# EAGLE design probe_v2.1 (EAGLE 8.5.2)
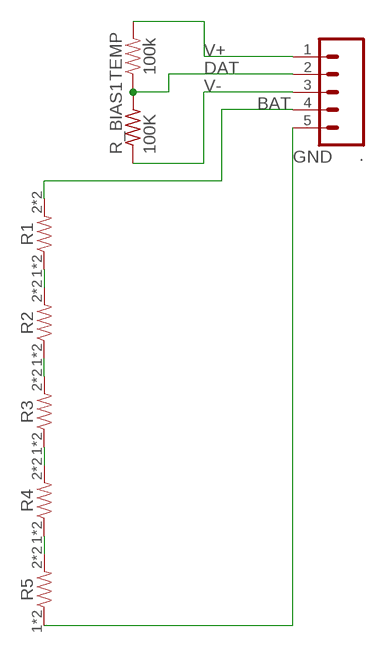
[diagram p0: schematic, sheet 1]

## Parts
.  CONN_05NO_SILK  [1X05_NO_SILK]
R1  DRES  [0603]
R2  DRES  [0603]
R3  DRES  [0603]
R4  DRES  [0603]
R5  DRES  [0603]
R_BIAS1  100K  FLIPFLOP-RES  [0805-THM]
TEMP  100k  1.8MOHM  [0603]

## Nets
BAT: ..4 R1.2 R1.P$2
DAT: ..2 R_BIAS1.2 TEMP.1
GND: ..5 R5.1 R5.P$1
N$3: R2.1 R2.P$1 R3.2 R3.P$2
N$4: R1.1 R1.P$1 R2.2 R2.P$2
N$9: R3.1 R3.P$1 R4.2 R4.P$2
N$10: R4.1 R4.P$1 R5.2 R5.P$2
V+: ..1 TEMP.2
V-: ..3 R_BIAS1.1

## Library data of the parts
. = SparkFun-Connectors:CONN_05: Multi connection point. Often used as Generic Header-pin footprint for 0.1 inch spaced/style header connections On any of the 0.1 inch spaced packages, you can populate with these: Break Away Headers - Straight <https://www.sparkfun.com/products/116> (PRT-00116) Break Away Male Headers - Right Angle <https://www.sparkfun.com/products/553> (PRT-00553) Female Headers <https://www.sparkfun.com/products/115> (PRT-00115) Break Away Headers - Machine Pin <https://www.sparkfun.com/products/117> (PRT-00117) Break Away Female Headers - Swiss Machine Pin <https://www.sparkfun.com/products/743> (PRT-00743) For SCREWTERMINALS and SPRING TERMINALS visit here: Screw Terimnals on SparkFun.com <https://www.sparkfun.com/search/results?term=Screw+Terminals> (5mm/3.5mm/2.54mm spacing) This device is also useful as a general connection point to wire up your design to another part of your project. Our various solder wires solder well into these plated through hole pads. Hook-Up Wire - Assortment (Stranded, 22 AWG) <https://www.sparkfun.com/products/11375> (PRT-11375) Hook-Up Wire - Assortment (Solid Core, 22 AWG) <https://www.sparkfun.com/products/11367> (PRT-11367) View the entire wire category on our website here <https://www.sparkfun.com/categories/141> Special notes: Molex polarized connector foot print use with SKU : PRT-08231 with associated crimp pins and housings. 1MM SMD Version SKU: PRT-10208
R1-R5 = dongjun_lib:DRES
R_BIAS1 = adafruit:FLIPFLOP-RES: Flip Flop resistor An 0805 resistor inside a standard 1/4W 5% resistor. Makes for easy mods
TEMP = SparkFun-Resistors 2:1.8MOHM: 1.8 MOhms ±5% 0.1W, 1/10W Chip Resistor 0603; PROD_ID: RES-13994; VALUE: 1.8M

## Board
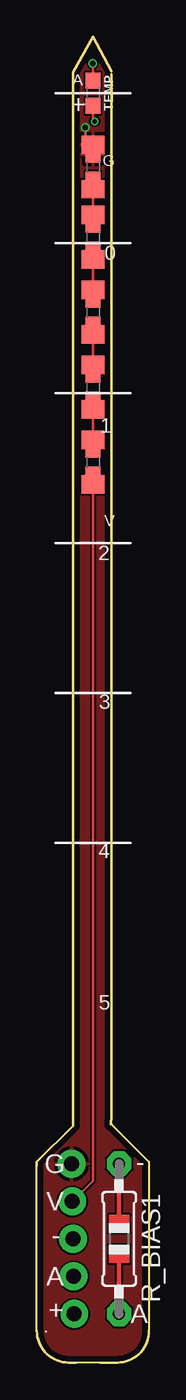
[diagram p1: board, top side]
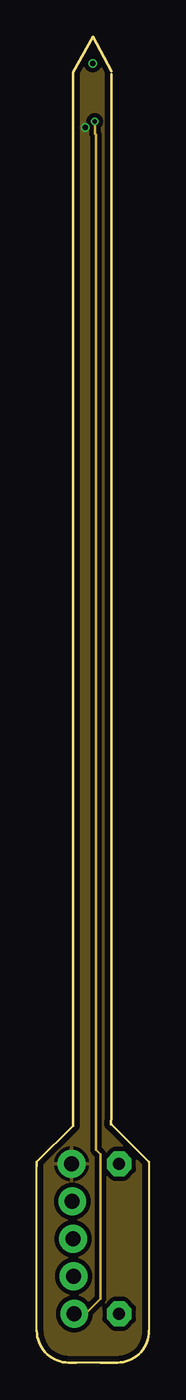
[diagram p2: board, inner layer Route2]
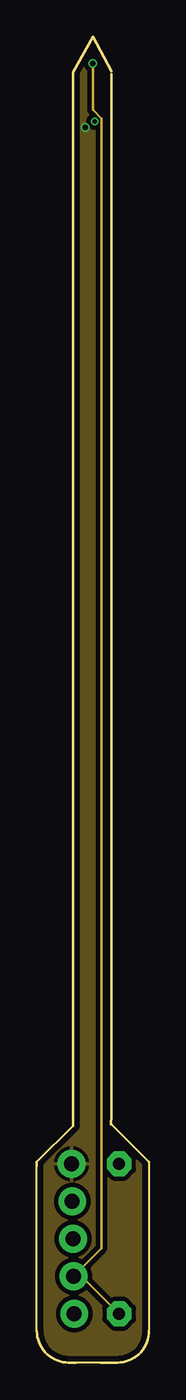
[diagram p3: board, inner layer Route3]
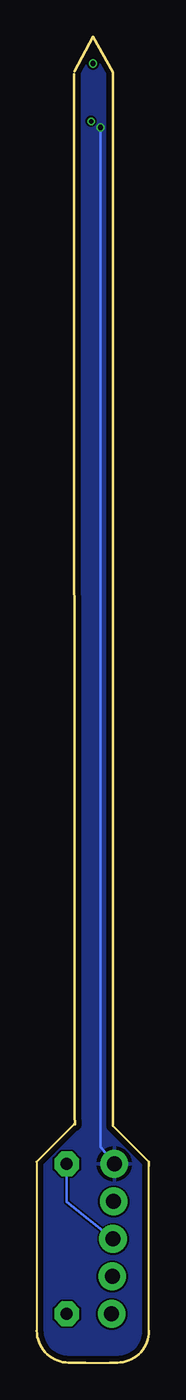
[diagram p4: board, bottom side, seen from below]

Size 7.62 x 89.79 mm. Coordinates in mm from the lower left corner, seen from the top.
Outline: 5.06,16.69 5.08,87.25
Outline: 0,13.59 0,2.16 arc90 2.16,0 2.67,0 4.32,0 5.46,0 arc90 7.62,2.16 7.62,13.59 5.08,16.13
Outline: 0,13.34 0,13.59
Outline: 5.06,16.73 5.04,16.14
Outline: 0,13.59 2.45,16.04 2.45,87.41 3.81,89.79 5.06,87.47
Copper layers (1*2*3*16): Top 0.035559375mm / dielectric 0.17018125mm / Route2 0.01778125mm / dielectric 47mil / Route3 0.01778125mm / dielectric 0.17018125mm / Bottom 0.035559375mm
Design rules "oshpark-4layer *": minimum track width 5mil, minimum drill 10mil, track to track 5mil, track to pad 5mil, pad to pad 5mil, via to via 5mil, smd to smd 5mil, copper to edge 15mil, drill to drill 6mil, minimum pad ring 4mil, minimum via ring 4mil, stop-mask expansion 2.5mil, vias tented up to drill 0mil, thermal gap 10mil

### Footprints (pad centres in the part's own frame; a part is rotated, then mirrored left to right if it is on the bottom)
1X05_NO_SILK = drill 1.016 pad 1.88: 1 0,0; 2 2.54,0; 3 5.08,0; 4 7.62,0; 5 10.16,0
0603 = smd 1.1 x 1: 1 -0.85,0; 2 0.85,0 | smd 1.25 x 1.55: P$1 -1.5,0; P$2 1.5,0
0805-THM = drill 0.813 pad 1.676 octagon: 1 -5.08,0; 2 5.08,0
0603' = smd 1.1 x 1: 1 -0.85,0; 2 0.85,0

### Placement (x,y rotation side)
.  2.54,3.3 91 top
R1  3.81,60.99 270 top
R2  3.81,66.07 270 top
R3  3.81,71.15 270 top
R4  3.81,76.23 270 top
R5  3.81,80.98 270 top
R_BIAS1  5.59,8.38 270 top
TEMP  100k  [0603']  3.81,85.98 270 top

### Tracks (layer width: path | path; a pad name or v marks a point on that pad's centre or on a via)
BAT
  Top 0.152: ..4 3.81,12.32 R1.P$2 R1.2
DAT  (via drill 0.35)
  Top 0.152: v3.8,87.99 3.81,87.97 TEMP.1
  Route3 0.152: R_BIAS1.2 3.05,5.84 ..2 4.39,7.74 4.39,84.26 3.8,84.86 v3.8,87.99 v3.8,88
GND  (via drill 0.35)
  Top 0.152: R5.P$1 3.29,83 v3.29,83.66
  Bottom 0.152: v3.29,83.66 3.29,14.6 ..5
  pour Bottom: 3.81,92.33 -1.27,88.52 -1.27,-2.92 8.89,-2.92 8.89,88.52
  pour Top: 3.81,92.33 -1.27,88.52 -1.27,-2.92 8.89,-2.92 8.89,88.52
  pour Route2 (isolate 0.305): 3.81,92.33 -2.54,88.52 -2.54,-2.92 8.89,-2.92 8.89,88.52
  pour Route3 (isolate 0.305): 3.81,92.33 -3.81,88.52 -3.81,-2.92 8.89,-2.92 8.89,88.52
N$3
  Top 0.152: R3.2 R3.P$2 R2.1 R2.P$1
N$4
  Top 0.152: R2.2 R2.P$2 R1.1 R1.P$1
N$9
  Top 0.152: R4.2 R4.P$2 R3.1 R3.P$1
N$10
  Top 0.152: R5.2 R5.P$2 R4.P$1 R4.1
V+  (via drill 0.3)
  Top 0.152: TEMP.2 3.81,84.2 v3.94,84.07
  Route2 0.152: ..1 3.3,3.3 4.32,4.32 4.32,14.1 4.01,14.4 4.01,83.17 3.94,83.25 v3.94,84.07
V-
  Bottom 0.152: R_BIAS1.1 5.59,10.88 ..3

### Text on the board
tPlace: 0 | 1 | 2 | 3 | 4 | 5
tNames: A | + | G | V | G | - | V | - | A | + | A
Document: 1. Short R_BIAS1 if using RTD thermistor. / It enables to use 2-wire PT100. / V+:Positive, DAT&V-: negative | 2. Short not using heat_resistor pads